# EAGLE design Hub_Teensy3_SPEWifi_V002 (EAGLE 6.1)
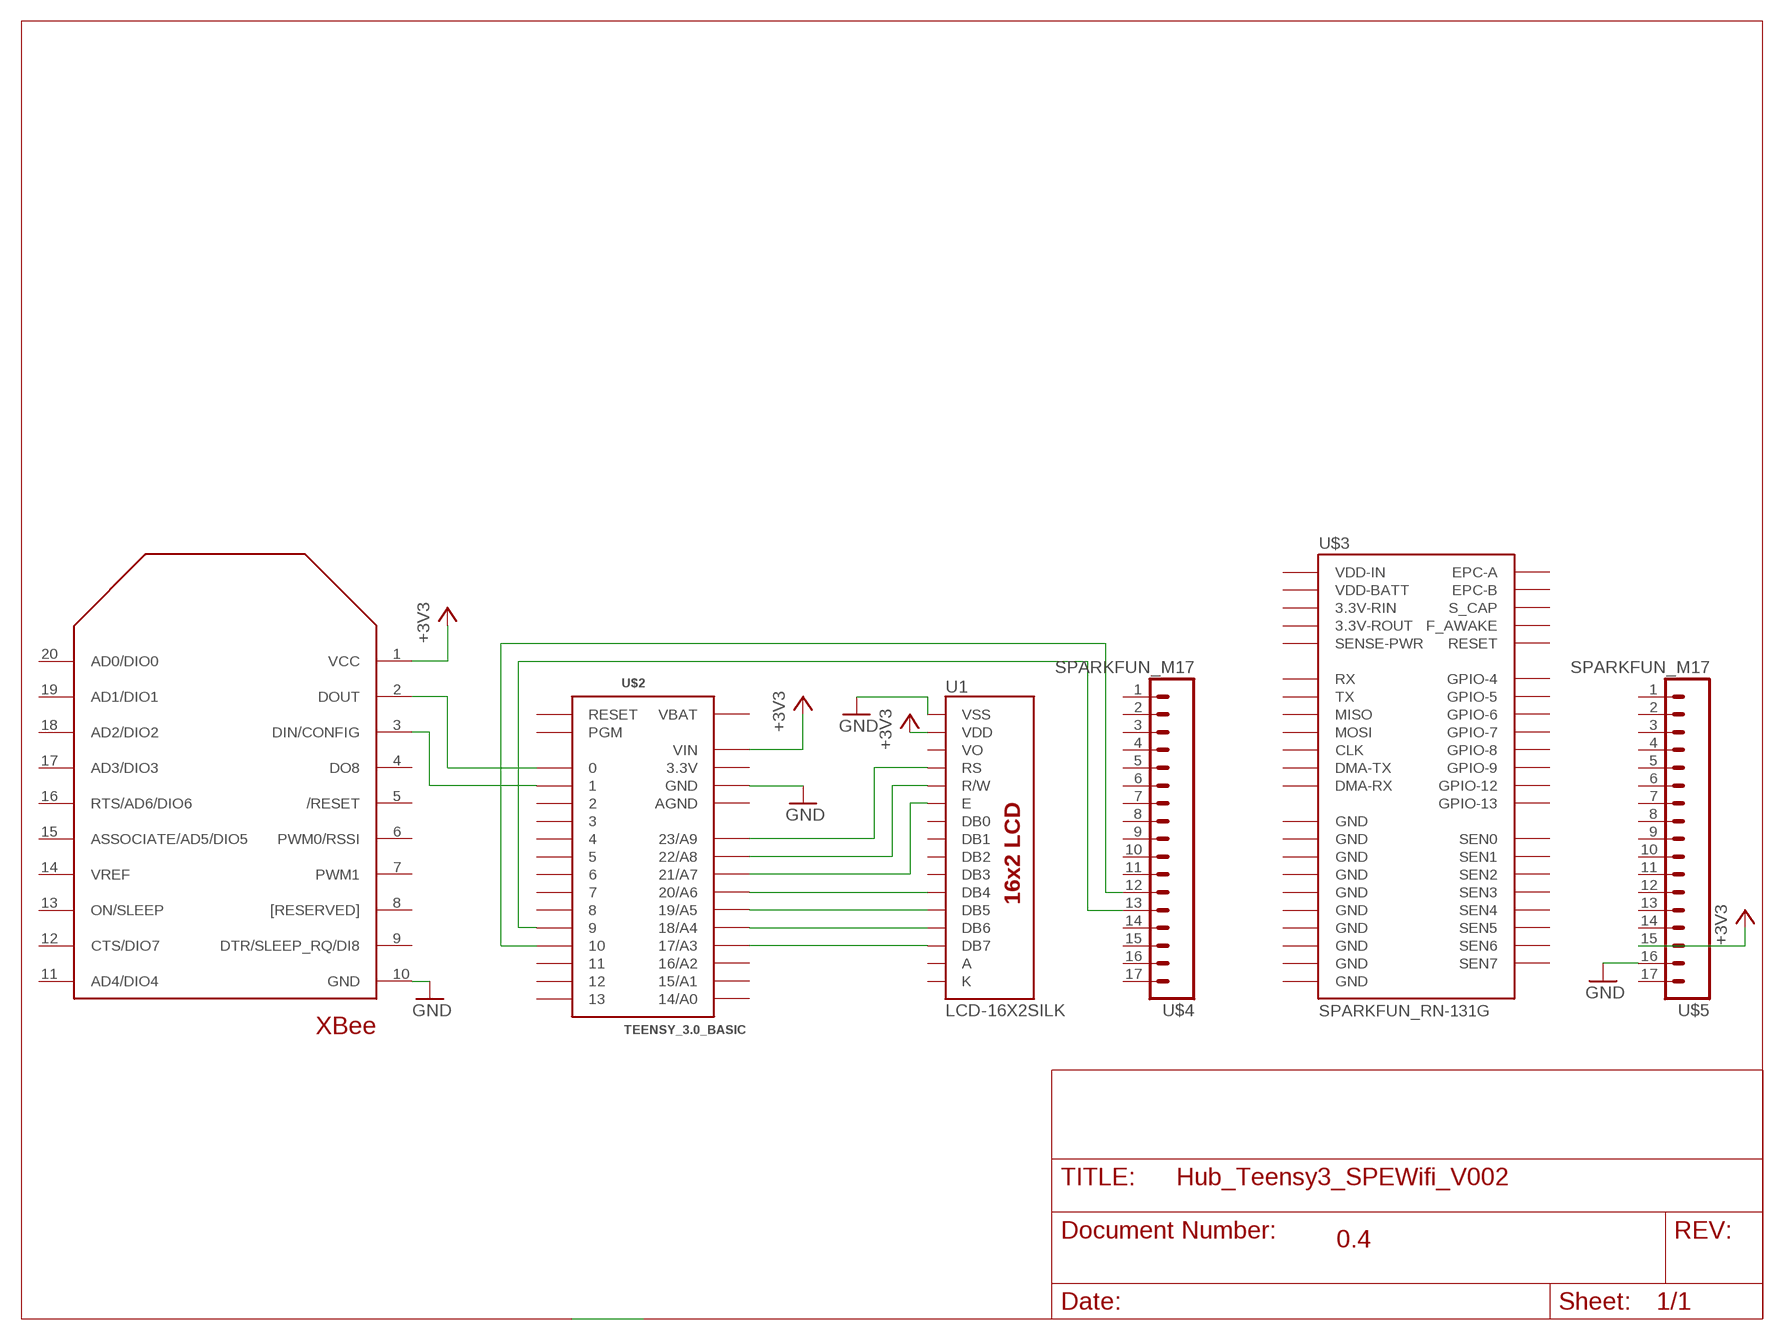
[diagram p0: schematic, sheet 1]

## Parts
U1  LCD-16X2SILK  [LCD-16X2]
U$1  XBEE  [XBEE]
U$2  TEENSY_3.0_BASIC  [TEENSY_3.0_BASIC]
U$3  SPARKFUN_RN-131G  [SPARKFUN_RN-131G]
U$4  SPARKFUN_M17  [SPARKFUN_1X17]
U$5  SPARKFUN_M17  [SPARKFUN_1X17]

## Nets
+3V3: U1.2(VDD) U$1.1(VCC) U$2.VIN U$5.15
GND: U1.1(VSS) U$1.10(GND) U$2.GND U$2.GND1(GND) U$5.16
N$1: U1.11(DB4) U$2.20/A6
N$2: U1.12(DB5) U$2.19/A5
N$3: U1.13(DB6) U$2.18/A4
N$4: U1.6(E) U$2.21/A7
N$5: U1.4(RS) U$2.23/A9
N$6: U1.5(R/W) U$2.22/A8
N$8: U$2.9 U$4.13
N$9: U$2.10 U$4.12
N$10: U1.14(DB7) U$2.17/A3
N$12: U$1.3(DIN/CONFIG) U$2.1
N$17: U$1.2(DOUT) U$2.0
Unconnected: U1.3(VO) U1.7(DB0) U1.8(DB1) U1.9(DB2) U1.10(DB3) U$1.4(DO8) U$1.5(/RESET) U$1.6(PWM0/RSSI) U$1.7(PWM1) U$1.8([RESERVED]) U$1.9(DTR/SLEEP_RQ/DI8) U$1.11(AD4/DIO4) U$1.12(CTS/DIO7) U$1.13(ON/SLEEP) U$1.14(VREF) U$1.15(ASSOCIATE/AD5/DIO5) U$1.16(RTS/AD6/DIO6) U$1.17(AD3/DIO3) U$1.18(AD2/DIO2) U$1.19(AD1/DIO1) U$1.20(AD0/DIO0) U$2.2 U$2.3 U$2.4 U$2.5 U$2.6 U$2.7 U$2.8 U$2.11 U$2.12 U$2.13 U$2.14/A0 U$2.15/A1 U$2.16/A2 U$2.PGM U$2.RESET U$3.P$1(SEN6) U$3.P$2(SEN4) U$3.P$3(SEN5) U$3.P$4(SEN7) U$3.P$5(RESET) U$3.P$6(EPC-A) U$3.P$7(EPC-B) U$3.P$8(S_CAP) U$3.P$9(F_AWAKE) U$3.P$10(GPIO-13) U$3.P$11(GPIO-12) U$3.P$12(RX) U$3.P$13(TX) U$3.P$14(MOSI) U$3.P$15(CLK) U$3.P$16(MISO) U$3.P$17(3.3V-ROUT) U$3.P$18(3.3V-RIN) U$3.P$19(GND) U$3.P$20(VDD-BATT) U$3.P$21(VDD-IN) U$3.P$22(DMA-TX) U$3.P$23(DMA-RX) U$3.P$24(GPIO-9) U$3.P$25(GPIO-8) U$3.P$26(GPIO-7) U$3.P$27(GPIO-6) U$3.P$28(GPIO-5) U$3.P$29(GPIO-4) U$3.P$30(SEN1) U$3.P$31(SEN2) U$3.P$32(SEN3) U$3.P$33(SENSE-PWR) U$3.P$34(SEN0) U$3.P$36(GND) U$3.P$37(GND) U$3.P$38(GND) U$3.P$39(GND) U$3.P$40(GND) U$3.P$41(GND) U$3.P$42(GND) U$3.P$43(GND) U$3.P$44(GND) U$4.1 U$4.2 U$4.3 U$4.4 U$4.5 U$4.6 U$4.7 U$4.8 U$4.9 U$4.10 U$4.11 U$4.14 U$4.15 U$4.16 U$4.17 U$5.1 U$5.2 U$5.3 U$5.4 U$5.5 U$5.6 U$5.7 U$5.8 U$5.9 U$5.10 U$5.11 U$5.12 U$5.13 U$5.14 U$5.17

## Notes on the sheet
- 0.4

## Power pins joined to a net without a drawn wire
3.3V: U$2.3.3V U$2.3.3V1(3.3V)
A: U1.15(A)
AGND: U$2.AGND
K: U1.16(K)
VBAT: U$2.VBAT

## Library data of the parts
U1 = SparkFun-Displays:LCD-16X2: Standard text-only 16x2 parallel input LCD
U$1 = CEDT:XBEE
U$2 = Teensy3-2.0:TEENSY_3.0_BASIC: Basic Teensy 3.0 with none of the 'inner' pins enabled. See '+4', 'AllAnalogPins", and 'AllPins' packages for additional pin holes, as needed.
U$3 = RN-131G_Breakout-v12:SPARKFUN_RN-131G: Roving Netowrks WiFLy GSX Module
U$4 U$5 = RN-131G_Breakout-v12:SPARKFUN_M17

## Board
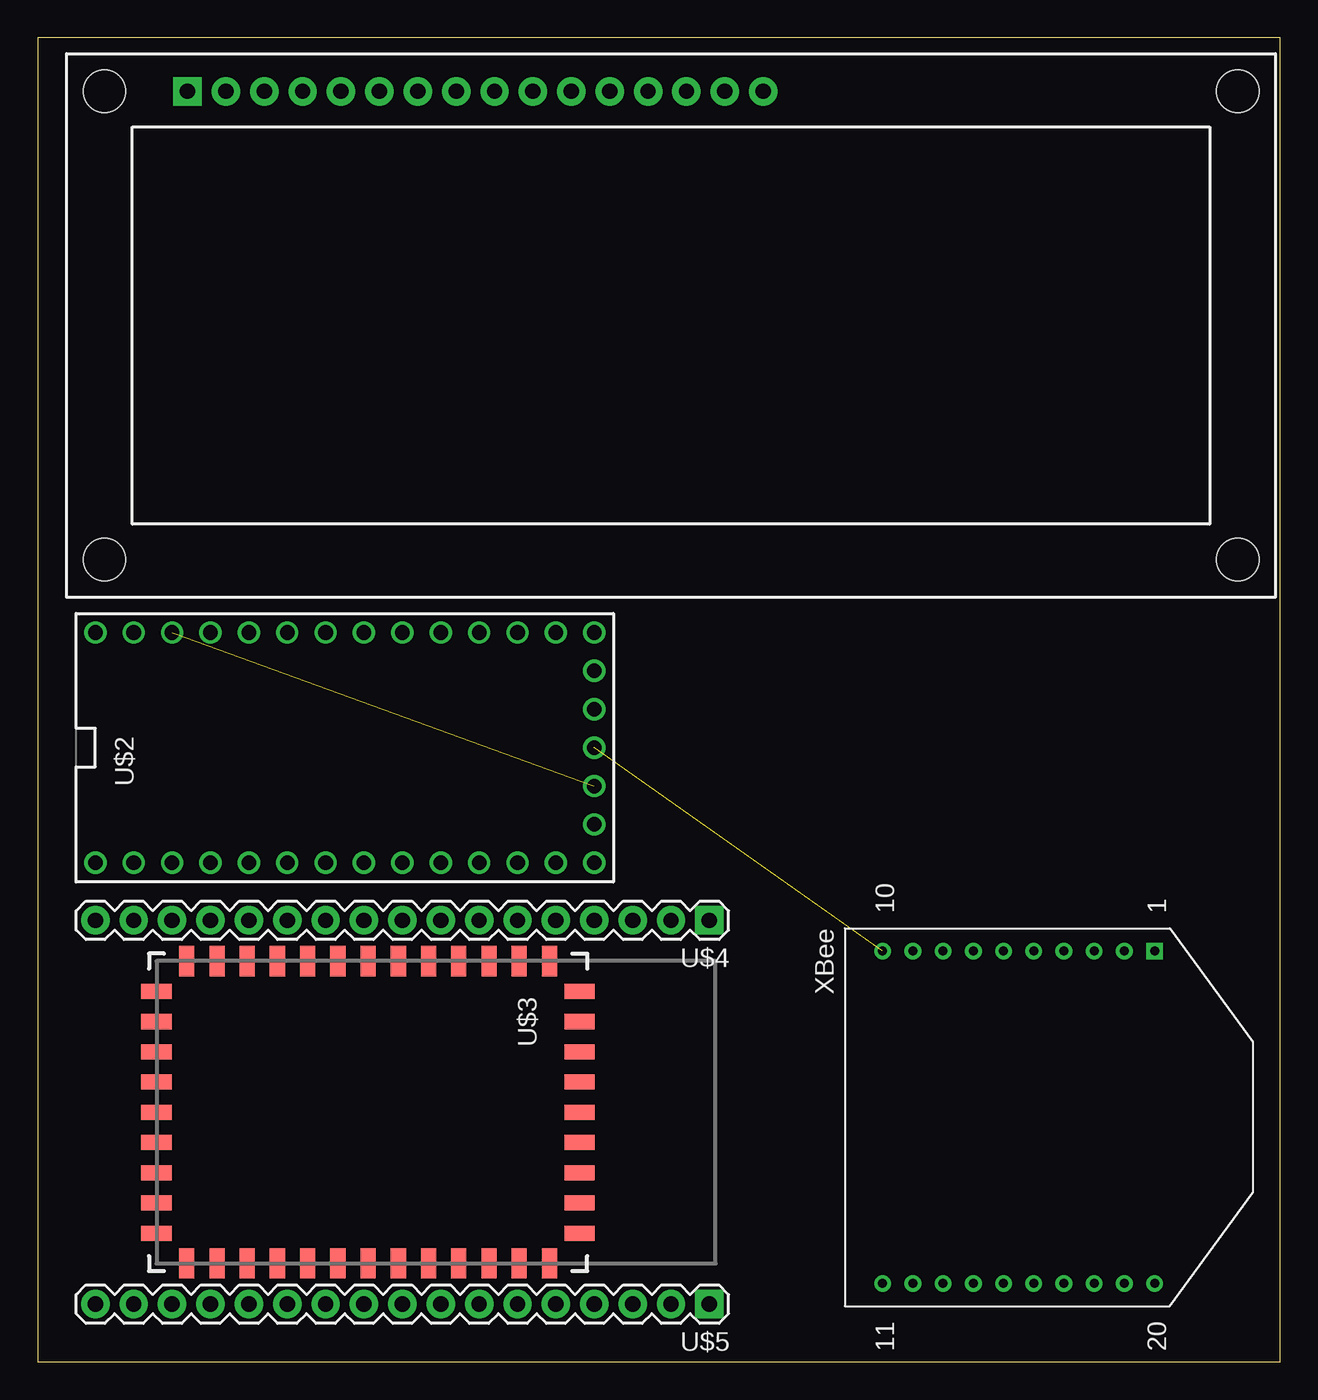
[diagram p1: board, top side]
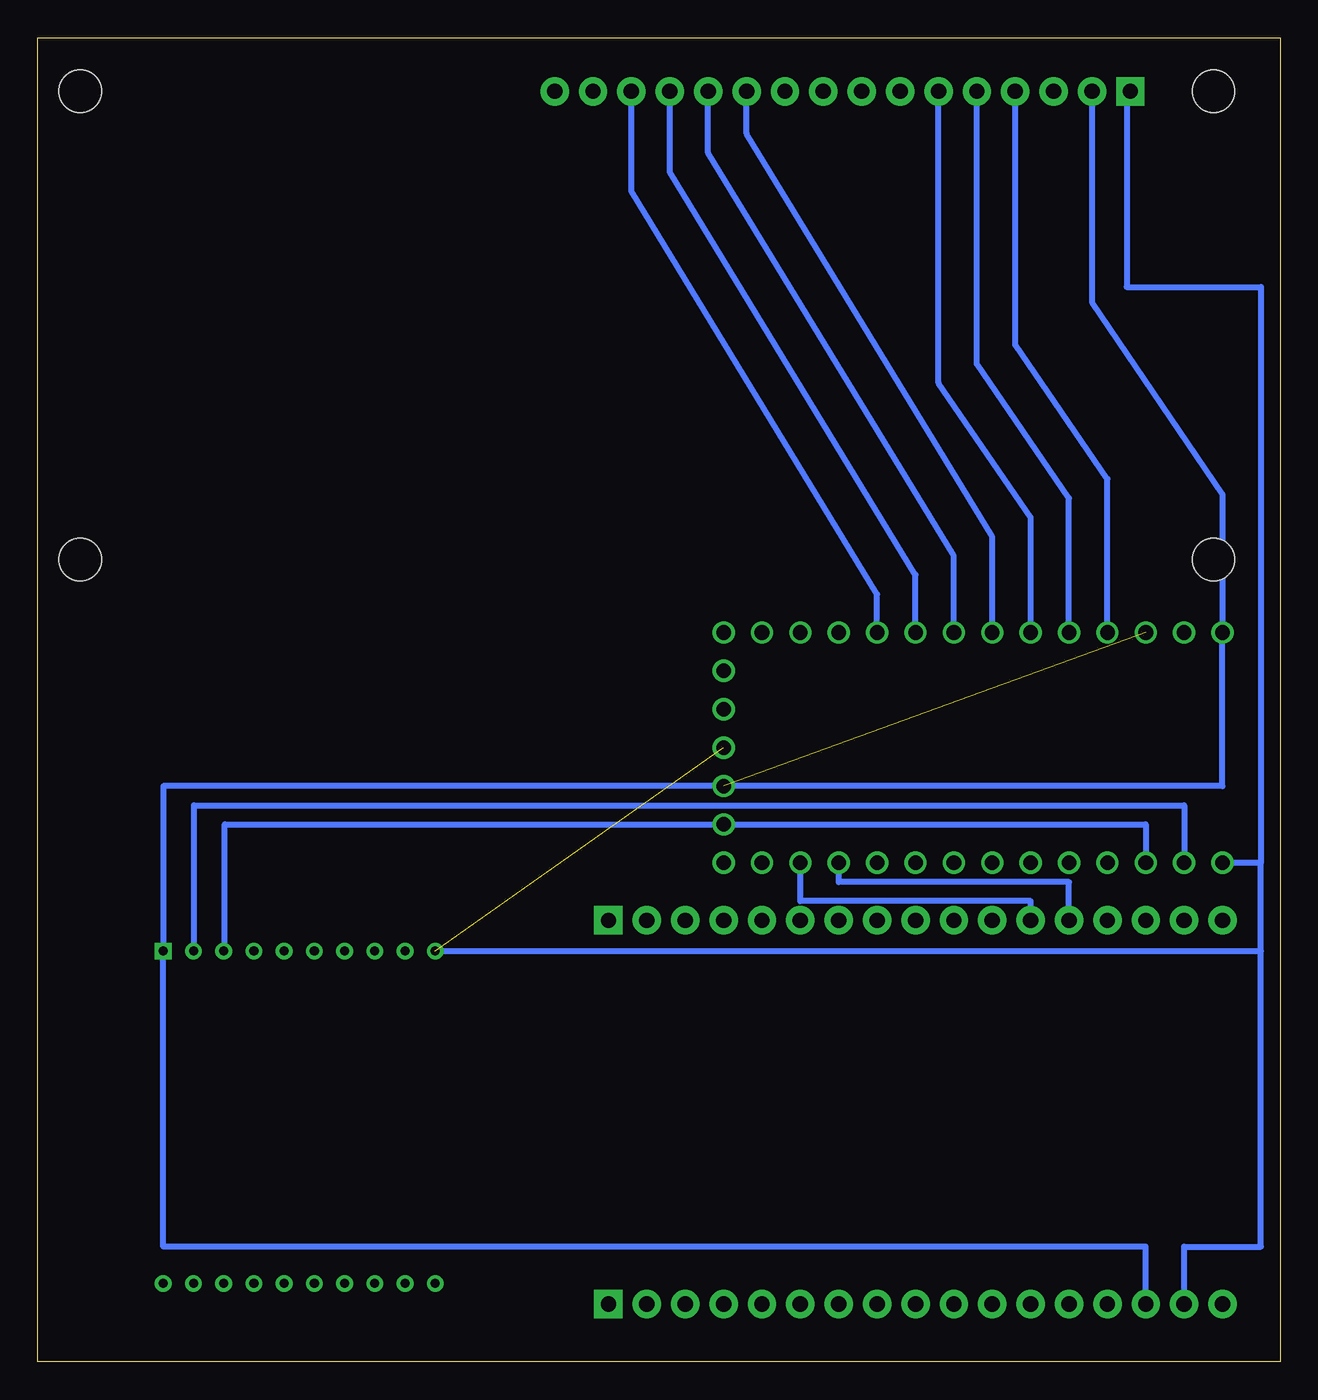
[diagram p2: board, bottom side, seen from below]

Size 82.22 x 87.62 mm. Coordinates in mm from the lower left corner, seen from the top.
Outline: 0,0 82.22,0 82.22,87.62 0,87.62 0,0
Copper layers (1*16): Top 0.035mm / dielectric 1.5mm / Bottom 0.035mm
Design rules: minimum track width 10mil, minimum drill 24mil, track to track 8mil, track to pad 8mil, pad to pad 8mil, via to via 8mil, smd to smd 8mil, copper to edge 40mil, drill to drill 8mil, minimum pad ring 10mil, minimum via ring 8mil, stop-mask expansion 4mil, vias tented up to drill 0mil, thermal gap 10mil

### Footprints (pad centres in the part's own frame; a part is rotated, then mirrored left to right if it is on the bottom)
LCD-16X2 = drill 1.016 pad 1.88 square: 1 -32,15.5 | drill 1.016 pad 1.88: 2 -29.46,15.5; 3 -26.92,15.5; 4 -24.38,15.5; 5 -21.84,15.5; 6 -19.3,15.5; 7 -16.76,15.5; 8 -14.22,15.5; 9 -11.68,15.5; 10 -9.14,15.5; 11 -6.6,15.5; 12 -4.06,15.5; 13 -1.52,15.5; 14 1.02,15.5; 15 3.56,15.5; 16 6.1,15.5 | hole 2.8: -37.5,15.5; -37.5,-15.5; 37.5,15.5; 37.5,-15.5
XBEE = drill 0.6 square: 1 0,0 | drill 0.6: 2 0,-2; 3 0,-4; 4 0,-6; 5 0,-8; 6 0,-10; 7 0,-12; 8 0,-14; 9 0,-16; 10 0,-18; 11 22,-18; 12 22,-16; 13 22,-14; 14 22,-12; 15 22,-10; 16 22,-8; 17 22,-6; 18 22,-4; 19 22,-2; 20 22,0
TEENSY_3.0_BASIC = drill 0.965: 0 -7.62,13.97; 1 -7.62,11.43; 2 -7.62,8.89; 3 -7.62,6.35; 3.3V 7.62,11.43; 3.3V1 -2.54,-16.51; 4 -7.62,3.81; 5 -7.62,1.27; 6 -7.62,-1.27; 7 -7.62,-3.81; 8 -7.62,-6.35; 9 -7.62,-8.89; 10 -7.62,-11.43; 11 -7.62,-13.97; 12 -7.62,-16.51; 13 7.62,-16.51; 14/A0 7.62,-13.97; 15/A1 7.62,-11.43; 16/A2 7.62,-8.89; 17/A3 7.62,-6.35; 18/A4 7.62,-3.81; 19/A5 7.62,-1.27; 20/A6 7.62,1.27; 21/A7 7.62,3.81; 22/A8 7.62,6.35; 23/A9 7.62,8.89; AGND 7.62,13.97; GND -7.62,16.51; GND1 0,-16.51; PGM 2.54,-16.51; RESET 5.08,-16.51; VBAT -5.08,-16.51; VIN 7.62,16.51
SPARKFUN_RN-131G = smd 2 x 1: P$1 -10,11; P$2 -10,9; P$3 -10,7; P$4 -10,5; P$5 -10,3; P$6 -10,1; P$7 -10,-1; P$8 -10,-3; P$9 -10,-5; P$10 -10,-7; P$11 -10,-9; P$12 -10,-11; P$13 -10,-13; P$23 10,-13; P$24 10,-11; P$25 10,-9; P$26 10,-7; P$27 10,-5; P$28 10,-3; P$29 10,-1; P$30 10,1; P$31 10,3; P$32 10,5; P$33 10,7; P$34 10,9; P$35 10,11 | smd 1 x 2: P$14 -8,-15; P$15 -6,-15; P$16 -4,-15; P$17 -2,-15; P$18 0,-15; P$19 2,-15; P$20 4,-15; P$21 6,-15; P$22 8,-15; P$36 8,13; P$37 6,13; P$38 4,13; P$39 2,13; P$40 0,13; P$41 -2,13; P$42 -4,13; P$43 -6,13; P$44 -8,13
SPARKFUN_1X17 = drill 1.016 pad 1.88 square: 1 0,0 | drill 1.016 pad 1.88: 2 2.54,0; 3 5.08,0; 4 7.62,0; 5 10.16,0; 6 12.7,0; 7 15.24,0; 8 17.78,0; 9 20.32,0; 10 22.86,0; 11 25.4,0; 12 27.94,0; 13 30.48,0; 14 33.02,0; 15 35.56,0; 16 38.1,0; 17 40.64,0

### Placement (x,y rotation side)
U1  41.91,68.58 0 top
U$1  73.91,27.18 270 top
U$2  20.32,40.64 90 top
U$3  22.86,16.51 270 top
U$4  44.45,29.21 180 top
U$5  44.45,3.81 180 top

### Tracks (layer width: path | path; a pad name or v marks a point on that pad's centre or on a via)
3.3V  (1 unrouted)
+3V3
  Bottom 0.406: U1.2 12.45,70.1 3.81,57.4 U$2.VIN 3.81,38.1 73.91,38.1 U$1.1 73.91,7.62 8.89,7.62 U$5.15
GND  (1 unrouted)
  Bottom 0.406: U$5.16 6.35,7.62 1.27,7.62 1.27,27.18 | 1.27,27.18 1.27,33.02 | 1.27,33.02 U$2.GND | U1.1 10.16,84.08 10.16,71.12 1.27,71.12 1.27,33.02 | U$1.10 1.27,27.18
N$1
  Bottom 0.406: U$2.20/A6 19.05,54.61 35.31,81.28 U1.11
N$2
  Bottom 0.406: U$2.19/A5 21.59,53.34 37.85,80.01 U1.12
N$3
  Bottom 0.406: U$2.18/A4 24.13,52.07 40.39,78.74 U1.13
N$4
  Bottom 0.406: U$2.21/A7 16.51,55.88 22.61,64.77 U1.6
N$5
  Bottom 0.406: U$2.23/A9 11.43,58.42 17.53,67.31 U1.4
N$6
  Bottom 0.406: U$2.22/A8 13.97,57.15 20.07,66.04 U1.5
N$8
  Bottom 0.406: U$4.13 13.97,31.75 29.21,31.75 U$2.9
N$9
  Bottom 0.406: U$4.12 16.51,30.48 31.75,30.48 U$2.10
N$10
  Bottom 0.406: U$2.17/A3 26.67,50.8 42.93,77.47 U1.14
N$12
  Bottom 0.406: U$1.3 69.85,27.18 69.85,35.56 8.89,35.56 U$2.1
N$17
  Bottom 0.406: U$1.2 71.88,27.18 71.88,36.83 6.35,36.83 U$2.0